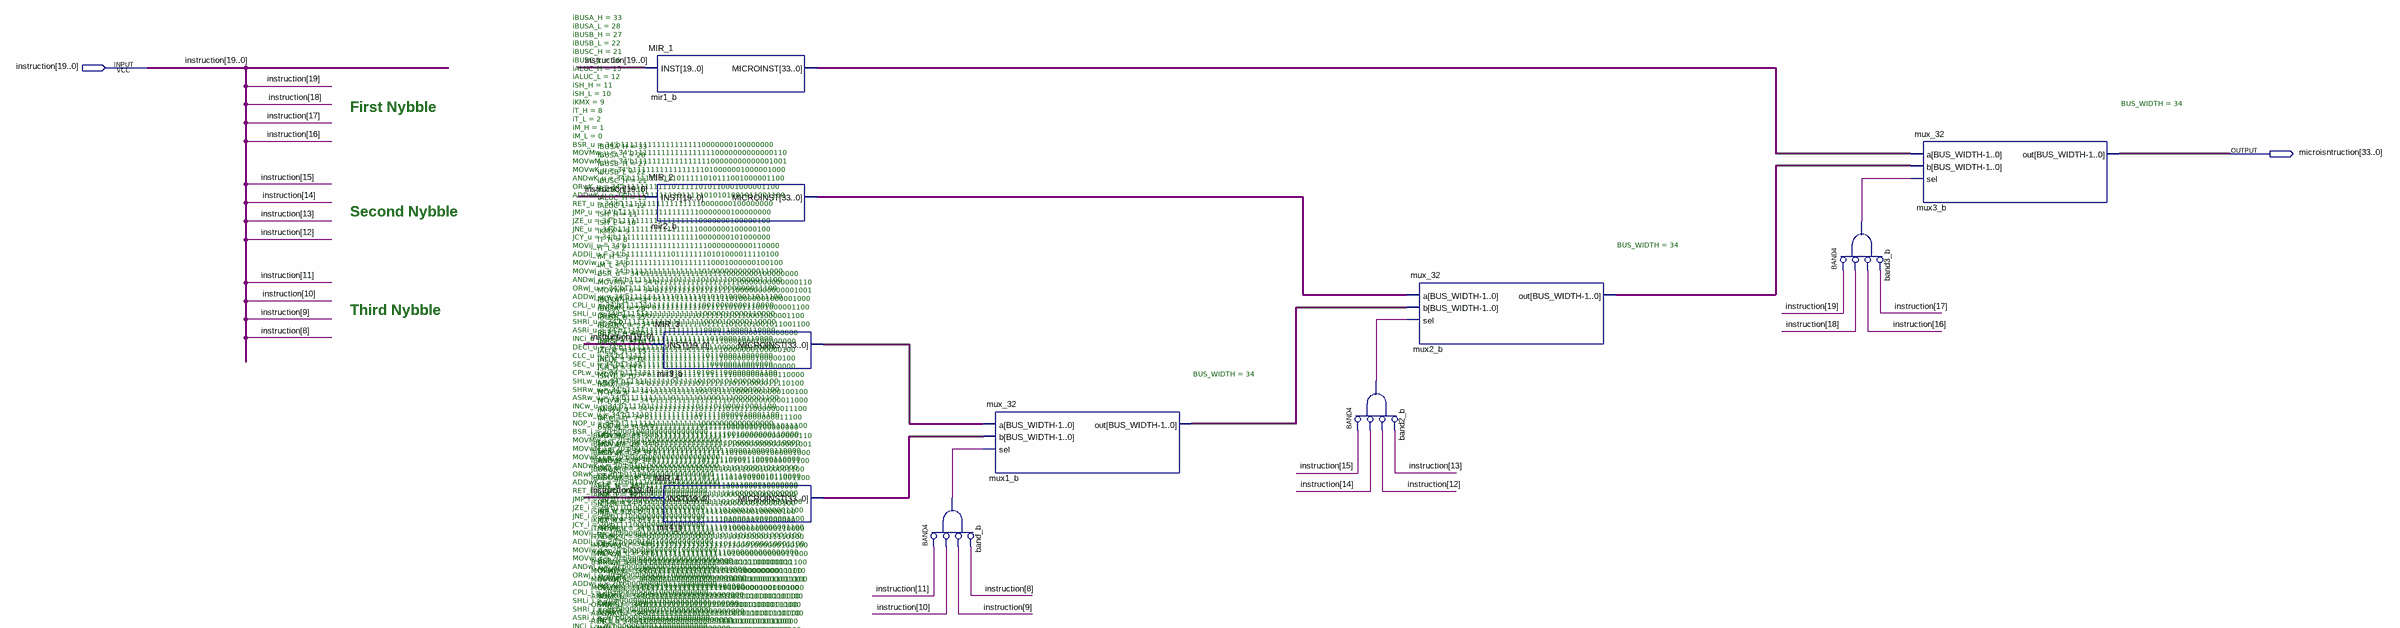
[diagram p0: schematic sheet]
// Quartus schematic decoder.bdf as structural Verilog: 10 symbols, 2 pins
module decoder (
  input  [19:0] instruction,
  output [33:0] microisntruction
);

  wire band2_b_out, band3_b_out, band_b_out;
  wire [33:0] mir1_b_microinst, mir2_b_microinst, mir3_b_microinst, mir4_b_microinst, mux1_b_out, mux2_b_out;

  MIR_1 #(.iBUSA_H(33), .iBUSA_L(28), .iBUSB_H(27), .iBUSB_L(22), .iBUSC_H(21), .iBUSC_L(16), .iALUC_H(15), .iALUC_L(12), .iSH_H(11), .iSH_L(10), .iKMX(9), .iT_H(8), .iT_L(2), .iM_H(1), .iM_L(0), .BSR_u(34'b1111111111111111110000000100000000), .MOVMw_u(34'b1111111111111111110000000000000110), .MOVwM_u(34'b1111111111111111100000000000001001), .MOVwK_u(34'b1111111111111111010000001000001000), .ANDwK_u(34'b1111111111011111010111001000001100), .ORwK_u(34'b1111111111011111010110001000001100), .ADDwK_u(34'b1111111111011111010101001011001100), .RET_u(34'b1111111111111111110000000100000000), .JMP_u(34'b1111111111111111110000000100000000), .JZE_u(34'b1111111111111111110000000100000100), .JNE_u(34'b1111111111111111110000000100000100), .JCY_u(34'b1111111111111111110000000101000000), .MOVij_u(34'b1111111111111111110000000000110000), .ADDij_u(34'b1111111111011111110101000011110100), .MOViw_u(34'b1111111111011111110001000000100100), .MOVwj_u(34'b1111111111111111010000000000011000), .ANDwj_u(34'b1111111111011111010111000000011100), .ORwj_u(34'b1111111111011111010110000000011100), .ADDwj_u(34'b1111111111011111010101000011011100), .CPLi_u(34'b1111111111111111110010000000110000), .SHLi_u(34'b1111111111111111110000010000110000), .SHRi_u(34'b1111111111111111110000100000110000), .ASRi_u(34'b1111111111111111110000110000110000), .INCi_u(34'b1111111111111111111101000010110000), .DECi_u(34'b1111111111111111111110000010110000), .CLC_u(34'b1111111111111111111011000010000000), .SEC_u(34'b1111111111111111111100000010000000), .CPLw_u(34'b1111111111011111010011000000001100), .SHLw_u(34'b1111111111011111010001010000001100), .SHRw_u(34'b1111111111011111010001100000001100), .ASRw_u(34'b1111111111011111010001110000001100), .INCw_u(34'b1111011111111111011101000010001100), .DECw_u(34'b1111011111111111011110000010001100), .NOP_u(34'b1111111111111111110000000000000000), .BSR_i(20'b00010000000000000000), .MOVMw_i(20'b00100000000000000000), .MOVwM_i(20'b00110000000000000000), .MOVwK_i(20'b01000000000000000000), .ANDwK_i(20'b01010000000000000000), .ORwK_i(20'b01100000000000000000), .ADDwK_i(20'b01110000000000000000), .RET_i(20'b10000000000000000000), .JMP_i(20'b11000000000000000000), .JZE_i(20'b11010000000000000000), .JNE_i(20'b11100000000000000000), .JCY_i(20'b11110000000000000000), .MOVij_i(20'b00001000000000000000), .ADDij_i(20'b00001001000000000000), .MOViw_i(20'b00000000000100000000), .MOVwj_i(20'b00000000010000000000), .ANDwj_i(20'b00000000010100000000), .ORwj_i(20'b00000000011000000000), .ADDwj_i(20'b00000000011100000000), .CPLi_i(20'b00000000100000000000), .SHLi_i(20'b00000000100100000000), .SHRi_i(20'b00000000101000000000), .ASRi_i(20'b00000000101100000000), .INCi_i(20'b00000000110000000000), .DECi_i(20'b00000000110100000000), .CLC_i(20'b00000000000000100000), .SEC_i(20'b00000000000000110000), .CPLw_i(20'b00000000000010000000), .SHLw_i(20'b00000000000010010000), .SHRw_i(20'b00000000000010100000), .ASRw_i(20'b00000000000010110000), .INCw_i(20'b00000000000011000000), .DECw_i(20'b00000000000011010000), .NOP_i(20'b00000000000011110000)) mir1_b (
    .INST(instruction), .MICROINST(mir1_b_microinst));
  MIR_2 #(.iBUSA_H(33), .iBUSA_L(28), .iBUSB_H(27), .iBUSB_L(22), .iBUSC_H(21), .iBUSC_L(16), .iALUC_H(15), .iALUC_L(12), .iSH_H(11), .iSH_L(10), .iKMX(9), .iT_H(8), .iT_L(2), .iM_H(1), .iM_L(0), .BSR_u(34'b1111111111111111110000000100000000), .MOVMw_u(34'b1111111111111111110000000000000110), .MOVwM_u(34'b1111111111111111100000000000001001), .MOVwK_u(34'b1111111111111111010000001000001000), .ANDwK_u(34'b1111111111011111010111001000001100), .ORwK_u(34'b1111111111011111010110001000001100), .ADDwK_u(34'b1111111111011111010101001011001100), .RET_u(34'b1111111111111111110000000100000000), .JMP_u(34'b1111111111111111110000000100000000), .JZE_u(34'b1111111111111111110000000100000100), .JNE_u(34'b1111111111111111110000000100000100), .JCY_u(34'b1111111111111111110000000101000000), .MOVij_u(34'b1111111111111111110000000000110000), .ADDij_u(34'b1111111111011111110101000011110100), .MOViw_u(34'b1111111111011111110001000000100100), .MOVwj_u(34'b1111111111111111010000000000011000), .ANDwj_u(34'b1111111111011111010111000000011100), .ORwj_u(34'b1111111111011111010110000000011100), .ADDwj_u(34'b1111111111011111010101000011011100), .CPLi_u(34'b1111111111111111110010000000110000), .SHLi_u(34'b1111111111111111110000010000110000), .SHRi_u(34'b1111111111111111110000100000110000), .ASRi_u(34'b1111111111111111110000110000110000), .INCi_u(34'b1111111111111111111101000010110000), .DECi_u(34'b1111111111111111111110000010110000), .CLC_u(34'b1111111111111111111011000010000000), .SEC_u(34'b1111111111111111111100000010000000), .CPLw_u(34'b1111111111011111010011000000001100), .SHLw_u(34'b1111111111011111010001010000001100), .SHRw_u(34'b1111111111011111010001100000001100), .ASRw_u(34'b1111111111011111010001110000001100), .INCw_u(34'b1111011111111111011101000010001100), .DECw_u(34'b1111011111111111011110000010001100), .NOP_u(34'b1111111111111111110000000000000000), .BSR_i(20'b00010000000000000000), .MOVMw_i(20'b00100000000000000000), .MOVwM_i(20'b00110000000000000000), .MOVwK_i(20'b01000000000000000000), .ANDwK_i(20'b01010000000000000000), .ORwK_i(20'b01100000000000000000), .ADDwK_i(20'b01110000000000000000), .RET_i(20'b10000000000000000000), .JMP_i(20'b11000000000000000000), .JZE_i(20'b11010000000000000000), .JNE_i(20'b11100000000000000000), .JCY_i(20'b11110000000000000000), .MOVij_i(20'b00001000000000000000), .ADDij_i(20'b00001001000000000000), .MOViw_i(20'b00000000000100000000), .MOVwj_i(20'b00000000010000000000), .ANDwj_i(20'b00000000010100000000), .ORwj_i(20'b00000000011000000000), .ADDwj_i(20'b00000000011100000000), .CPLi_i(20'b00000000100000000000), .SHLi_i(20'b00000000100100000000), .SHRi_i(20'b00000000101000000000), .ASRi_i(20'b00000000101100000000), .INCi_i(20'b00000000110000000000), .DECi_i(20'b00000000110100000000), .CLC_i(20'b00000000000000100000), .SEC_i(20'b00000000000000110000), .CPLw_i(20'b00000000000010000000), .SHLw_i(20'b00000000000010010000), .SHRw_i(20'b00000000000010100000), .ASRw_i(20'b00000000000010110000), .INCw_i(20'b00000000000011000000), .DECw_i(20'b00000000000011010000), .NOP_i(20'b00000000000011110000)) mir2_b (
    .INST(instruction), .MICROINST(mir2_b_microinst));
  MIR_3 #(.iBUSA_H(33), .iBUSA_L(28), .iBUSB_H(27), .iBUSB_L(22), .iBUSC_H(21), .iBUSC_L(16), .iALUC_H(15), .iALUC_L(12), .iSH_H(11), .iSH_L(10), .iKMX(9), .iT_H(8), .iT_L(2), .iM_H(1), .iM_L(0), .BSR_u(34'b1111111111111111110000000100000000), .MOVMw_u(34'b1111111111111111110000000000000110), .MOVwM_u(34'b1111111111111111100000000000001001), .MOVwK_u(34'b1111111111111111010000001000001000), .ANDwK_u(34'b1111111111011111010111001000001100), .ORwK_u(34'b1111111111011111010110001000001100), .ADDwK_u(34'b1111111111011111010101001011001100), .RET_u(34'b1111111111111111110000000100000000), .JMP_u(34'b1111111111111111110000000100000000), .JZE_u(34'b1111111111111111110000000100000100), .JNE_u(34'b1111111111111111110000000100000100), .JCY_u(34'b1111111111111111110000000101000000), .MOVij_u(34'b1111111111111111110000000000110000), .ADDij_u(34'b1111111111011111110101000011110100), .MOViw_u(34'b1111111111011111110001000000100100), .MOVwj_u(34'b1111111111111111010000000000011000), .ANDwj_u(34'b1111111111011111010111000000011100), .ORwj_u(34'b1111111111011111010110000000011100), .ADDwj_u(34'b1111111111011111010101000011011100), .CPLi_u(34'b1111111111111111110010000000110000), .SHLi_u(34'b1111111111111111110000010000110000), .SHRi_u(34'b1111111111111111110000100000110000), .ASRi_u(34'b1111111111111111110000110000110000), .INCi_u(34'b1111111111111111111101000010110000), .DECi_u(34'b1111111111111111111110000010110000), .CLC_u(34'b1111111111111111111011000010000000), .SEC_u(34'b1111111111111111111100000010000000), .CPLw_u(34'b1111111111011111010011000000001100), .SHLw_u(34'b1111111111011111010001010000001100), .SHRw_u(34'b1111111111011111010001100000001100), .ASRw_u(34'b1111111111011111010001110000001100), .INCw_u(34'b1111011111111111011101000010001100), .DECw_u(34'b1111011111111111011110000010001100), .NOP_u(34'b1111111111111111110000000000000000), .BSR_i(20'b00010000000000000000), .MOVMw_i(20'b00100000000000000000), .MOVwM_i(20'b00110000000000000000), .MOVwK_i(20'b01000000000000000000), .ANDwK_i(20'b01010000000000000000), .ORwK_i(20'b01100000000000000000), .ADDwK_i(20'b01110000000000000000), .RET_i(20'b10000000000000000000), .JMP_i(20'b11000000000000000000), .JZE_i(20'b11010000000000000000), .JNE_i(20'b11100000000000000000), .JCY_i(20'b11110000000000000000), .MOVij_i(20'b00001000000000000000), .ADDij_i(20'b00001001000000000000), .MOViw_i(20'b00000000000100000000), .MOVwj_i(20'b00000000010000000000), .ANDwj_i(20'b00000000010100000000), .ORwj_i(20'b00000000011000000000), .ADDwj_i(20'b00000000011100000000), .CPLi_i(20'b00000000100000000000), .SHLi_i(20'b00000000100100000000), .SHRi_i(20'b00000000101000000000), .ASRi_i(20'b00000000101100000000), .INCi_i(20'b00000000110000000000), .DECi_i(20'b00000000110100000000), .CLC_i(20'b00000000000000100000), .SEC_i(20'b00000000000000110000), .CPLw_i(20'b00000000000010000000), .SHLw_i(20'b00000000000010010000), .SHRw_i(20'b00000000000010100000), .ASRw_i(20'b00000000000010110000), .INCw_i(20'b00000000000011000000), .DECw_i(20'b00000000000011010000), .NOP_i(20'b00000000000011110000)) mir3_b (
    .INST(instruction), .MICROINST(mir3_b_microinst));
  MIR_4 #(.iBUSA_H(33), .iBUSA_L(28), .iBUSB_H(27), .iBUSB_L(22), .iBUSC_H(21), .iBUSC_L(16), .iALUC_H(15), .iALUC_L(12), .iSH_H(11), .iSH_L(10), .iKMX(9), .iT_H(8), .iT_L(2), .iM_H(1), .iM_L(0), .BSR_u(34'b1111111111111111110000000100000000), .MOVMw_u(34'b1111111111111111110000000000000110), .MOVwM_u(34'b1111111111111111100000000000001001), .MOVwK_u(34'b1111111111111111010000001000001000), .ANDwK_u(34'b1111111111011111010111001000001100), .ORwK_u(34'b1111111111011111010110001000001100), .ADDwK_u(34'b1111111111011111010101001011001100), .RET_u(34'b1111111111111111110000000100000000), .JMP_u(34'b1111111111111111110000000100000000), .JZE_u(34'b1111111111111111110000000100000100), .JNE_u(34'b1111111111111111110000000100000100), .JCY_u(34'b1111111111111111110000000101000000), .MOVij_u(34'b1111111111111111110000000000110000), .ADDij_u(34'b1111111111011111110101000011110100), .MOViw_u(34'b1111111111011111110001000000100100), .MOVwj_u(34'b1111111111111111010000000000011000), .ANDwj_u(34'b1111111111011111010111000000011100), .ORwj_u(34'b1111111111011111010110000000011100), .ADDwj_u(34'b1111111111011111010101000011011100), .CPLi_u(34'b1111111111111111110010000000110000), .SHLi_u(34'b1111111111111111110000010000110000), .SHRi_u(34'b1111111111111111110000100000110000), .ASRi_u(34'b1111111111111111110000110000110000), .INCi_u(34'b1111111111111111111101000010110000), .DECi_u(34'b1111111111111111111110000010110000), .CLC_u(34'b1111111111111111111011000010000000), .SEC_u(34'b1111111111111111111100000010000000), .CPLw_u(34'b1111111111011111010011000000001100), .SHLw_u(34'b1111111111011111010001010000001100), .SHRw_u(34'b1111111111011111010001100000001100), .ASRw_u(34'b1111111111011111010001110000001100), .INCw_u(34'b1111011111111111011101000010001100), .DECw_u(34'b1111011111111111011110000010001100), .NOP_u(34'b1111111111111111110000000000000000), .BSR_i(20'b00010000000000000000), .MOVMw_i(20'b00100000000000000000), .MOVwM_i(20'b00110000000000000000), .MOVwK_i(20'b01000000000000000000), .ANDwK_i(20'b01010000000000000000), .ORwK_i(20'b01100000000000000000), .ADDwK_i(20'b01110000000000000000), .RET_i(20'b10000000000000000000), .JMP_i(20'b11000000000000000000), .JZE_i(20'b11010000000000000000), .JNE_i(20'b11100000000000000000), .JCY_i(20'b11110000000000000000), .MOVij_i(20'b00001000000000000000), .ADDij_i(20'b00001001000000000000), .MOViw_i(20'b00000000000100000000), .MOVwj_i(20'b00000000010000000000), .ANDwj_i(20'b00000000010100000000), .ORwj_i(20'b00000000011000000000), .ADDwj_i(20'b00000000011100000000), .CPLi_i(20'b00000000100000000000), .SHLi_i(20'b00000000100100000000), .SHRi_i(20'b00000000101000000000), .ASRi_i(20'b00000000101100000000), .INCi_i(20'b00000000110000000000), .DECi_i(20'b00000000110100000000), .CLC_i(20'b00000000000000100000), .SEC_i(20'b00000000000000110000), .CPLw_i(20'b00000000000010000000), .SHLw_i(20'b00000000000010010000), .SHRw_i(20'b00000000000010100000), .ASRw_i(20'b00000000000010110000), .INCw_i(20'b00000000000011000000), .DECw_i(20'b00000000000011010000), .NOP_i(20'b00000000000011110000)) mir4_b (
    .INST(instruction), .MICROINST(mir4_b_microinst));
  and band_b (band_b_out, ~instruction[11], ~instruction[10], ~instruction[9], ~instruction[8]);  // BAND4
  mux_32 #(.BUS_WIDTH(34)) mux1_b (.a(mir3_b_microinst), .b(mir4_b_microinst), .sel(band_b_out), .out(mux1_b_out));
  and band2_b (band2_b_out, ~instruction[15], ~instruction[14], ~instruction[12], ~instruction[13]);  // BAND4
  mux_32 #(.BUS_WIDTH(34)) mux2_b (.a(mir2_b_microinst), .b(mux1_b_out), .sel(band2_b_out), .out(mux2_b_out));
  and band3_b (band3_b_out, ~instruction[19], ~instruction[18], ~instruction[16], ~instruction[17]);  // BAND4
  mux_32 #(.BUS_WIDTH(34)) mux3_b (.a(mir1_b_microinst), .b(mux2_b_out), .sel(band3_b_out), .out(microisntruction));

  // Notes on the sheet:
  //   First Nybble
  //   Second Nybble
  //   Third Nybble
endmodule
